# Altium schematic sheet 05_Connector.SchDoc
size A4; SheetNumber: 5; SheetTotal: 5
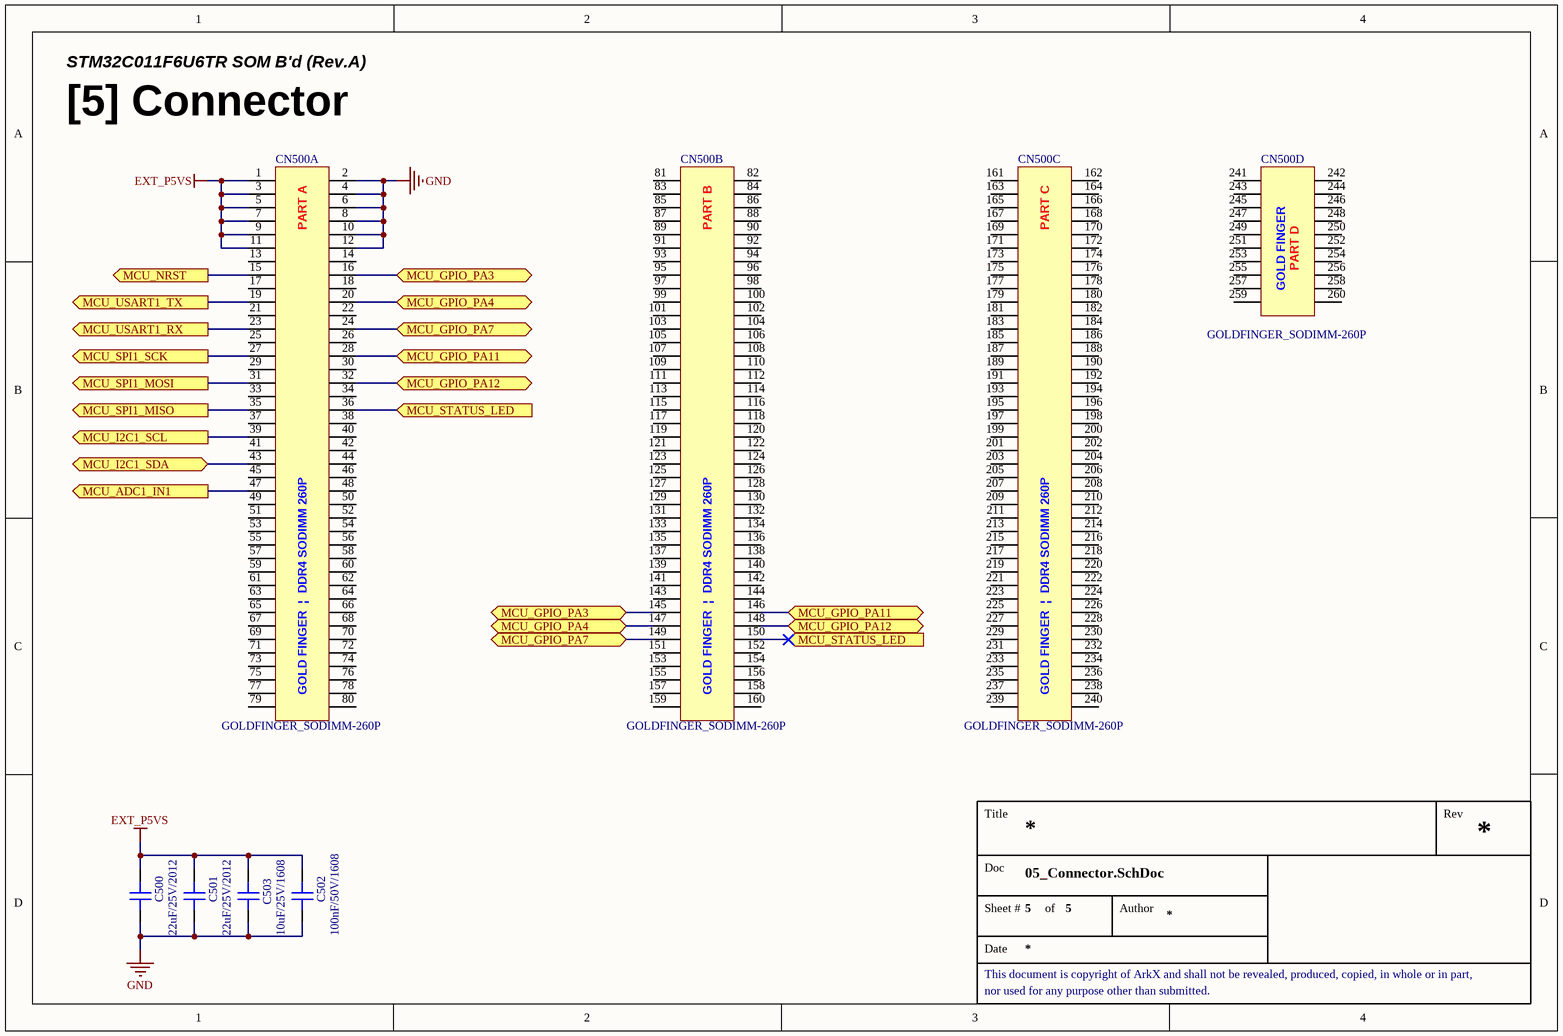
[diagram p0: 05_Connector.SchDoc]

## Parts
C500  22uF/25V/2012  [CAP 2012 (0805_INCH)]
C501  22uF/25V/2012  [CAP 2012 (0805_INCH)]
C502  100nF/50V/1608  [CAP 1608 (0603_INCH)]
C503  10uF/25V/1608  [CAP 1608 (0603_INCH)]
CN500  GOLDFINGER_SODIMM-260P  [CON_DDR4-SODIMM-260P_EDGE-CONNECTOR]  (parts A,B,C,D of 4)

## Ports
MCU_ADC1_IN1 (out), MCU_GPIO_PA3 (bidir), MCU_GPIO_PA4 (bidir), MCU_GPIO_PA7 (bidir), MCU_GPIO_PA11 (bidir), MCU_GPIO_PA12 (bidir), MCU_I2C1_SCL (out), MCU_I2C1_SDA (bidir), MCU_NRST (out), MCU_SPI1_MISO (out), MCU_SPI1_MOSI (out), MCU_SPI1_SCK (out), MCU_STATUS_LED (in), MCU_USART1_RX (out), MCU_USART1_TX (out)

## Nets
EXT_P5VS: C500.2 C501.2 C502.2 C503.2 CN500.1 CN500.3 CN500.5 CN500.7 CN500.9 CN500.11
GND: C500.1 C501.1 C502.1 C503.1 CN500.2 CN500.4 CN500.6 CN500.8 CN500.10 CN500.12
MCU_ADC1_IN1: CN500.47 ; port MCU_ADC1_IN1
MCU_GPIO_PA3: CN500.16 CN500.145 ; port MCU_GPIO_PA3
MCU_GPIO_PA4: CN500.20 CN500.147 ; port MCU_GPIO_PA4
MCU_GPIO_PA7: CN500.24 CN500.149 ; port MCU_GPIO_PA7
MCU_GPIO_PA11: CN500.28 CN500.146 ; port MCU_GPIO_PA11
MCU_GPIO_PA12: CN500.32 CN500.148 ; port MCU_GPIO_PA12
MCU_I2C1_SCL: CN500.39 ; port MCU_I2C1_SCL
MCU_I2C1_SDA: CN500.43 ; port MCU_I2C1_SDA
MCU_NRST: CN500.15 ; port MCU_NRST
MCU_SPI1_MISO: CN500.35 ; port MCU_SPI1_MISO
MCU_SPI1_MOSI: CN500.31 ; port MCU_SPI1_MOSI
MCU_SPI1_SCK: CN500.27 ; port MCU_SPI1_SCK
MCU_STATUS_LED: CN500.36 CN500.150 ; port MCU_STATUS_LED
MCU_USART1_RX: CN500.23 ; port MCU_USART1_RX
MCU_USART1_TX: CN500.19 ; port MCU_USART1_TX

Not connected (* = marked no-connect by the designer): CN500 13 14 17 18 21 22 25 26 29 30 33 34 37 38 40 41 42 44 45 46 48 49 50 51 52 53 54 55 56 57 58 59 60 61 62 63 64 65 66 67 68 69 70 71 72 73 74 75 76 77 78 79 80 81 82 83 84 85 86 87 88 89 90 91 92 93 94 95 96 97 98 99 100 101 102 103 104 105 106 107 108 109 110 111 112 113 114 115 116 117 118 119 120 121 122 123 124 125 126 127 128 129 130 131 132 133 134 135 136 137 138 139 140 141 142 143 144 151 152 153 154 155 156 157 158 159 160 161 162 163 164 165 166 167 168 169 170 171 172 173 174 175 176 177 178 179 180 181 182 183 184 185 186 187 188 189 190 191 192 193 194 195 196 197 198 199 200 201 202 203 204 205 206 207 208 209 210 211 212 213 214 215 216 217 218 219 220 221 222 223 224 225 226 227 228 229 230 231 232 233 234 235 236 237 238 239 240 241 242 243 244 245 246 247 248 249 250 251 252 253 254 255 256 257 258 259 260

## Notes on the sheet
- STM32C011F6U6TR SOM B'd (Rev.A)
- [5] Connector
- Title
- Rev
- Doc
- Sheet #
- of
- Author
- This document is copyright of ArkX and shall not be revealed, produced, copied, in whole or in part,
- Date
- nor used for any purpose other than submitted.
- (in symbol CON_GOLD-FINGER_DDR4-SODIMM-260P, part A) PART A; GOLD FINGER  |  DDR4 SODIMM 260P
- (in symbol CON_GOLD-FINGER_DDR4-SODIMM-260P, part B) PART B; GOLD FINGER  |  DDR4 SODIMM 260P
- (in symbol CON_GOLD-FINGER_DDR4-SODIMM-260P, part C) PART C; GOLD FINGER  |  DDR4 SODIMM 260P
- (in symbol CON_GOLD-FINGER_DDR4-SODIMM-260P, part D) GOLD FINGER; PART D

## Library data of the parts
C500 C501 = CAP_22uF/25V/2012: Ceramic CAP_22uF/25V/2012; LCSC Part #: C45783; JLCPCB Part Type: Basic Part
C502 = CAP_100nF/50V/1608: Ceramic CAP_100nF/50V/1608; LCSC Part #: C14663; JLCPCB Part Type: Basic Part
C503 = CAP_10uF/25V/1608: Ceramic CAP_10uF/25V/1608; LCSC Part #: C96446; JLCPCB Part Type: Basic Part
CN500 = CON_GOLD-FINGER_DDR4-SODIMM-260P: GOLD-FINGER_DDR4-SODIMM-260P; Mating Part Number: 2309409-1